# EAGLE design Stage_Driver_v7 (EAGLE 9.4.2)
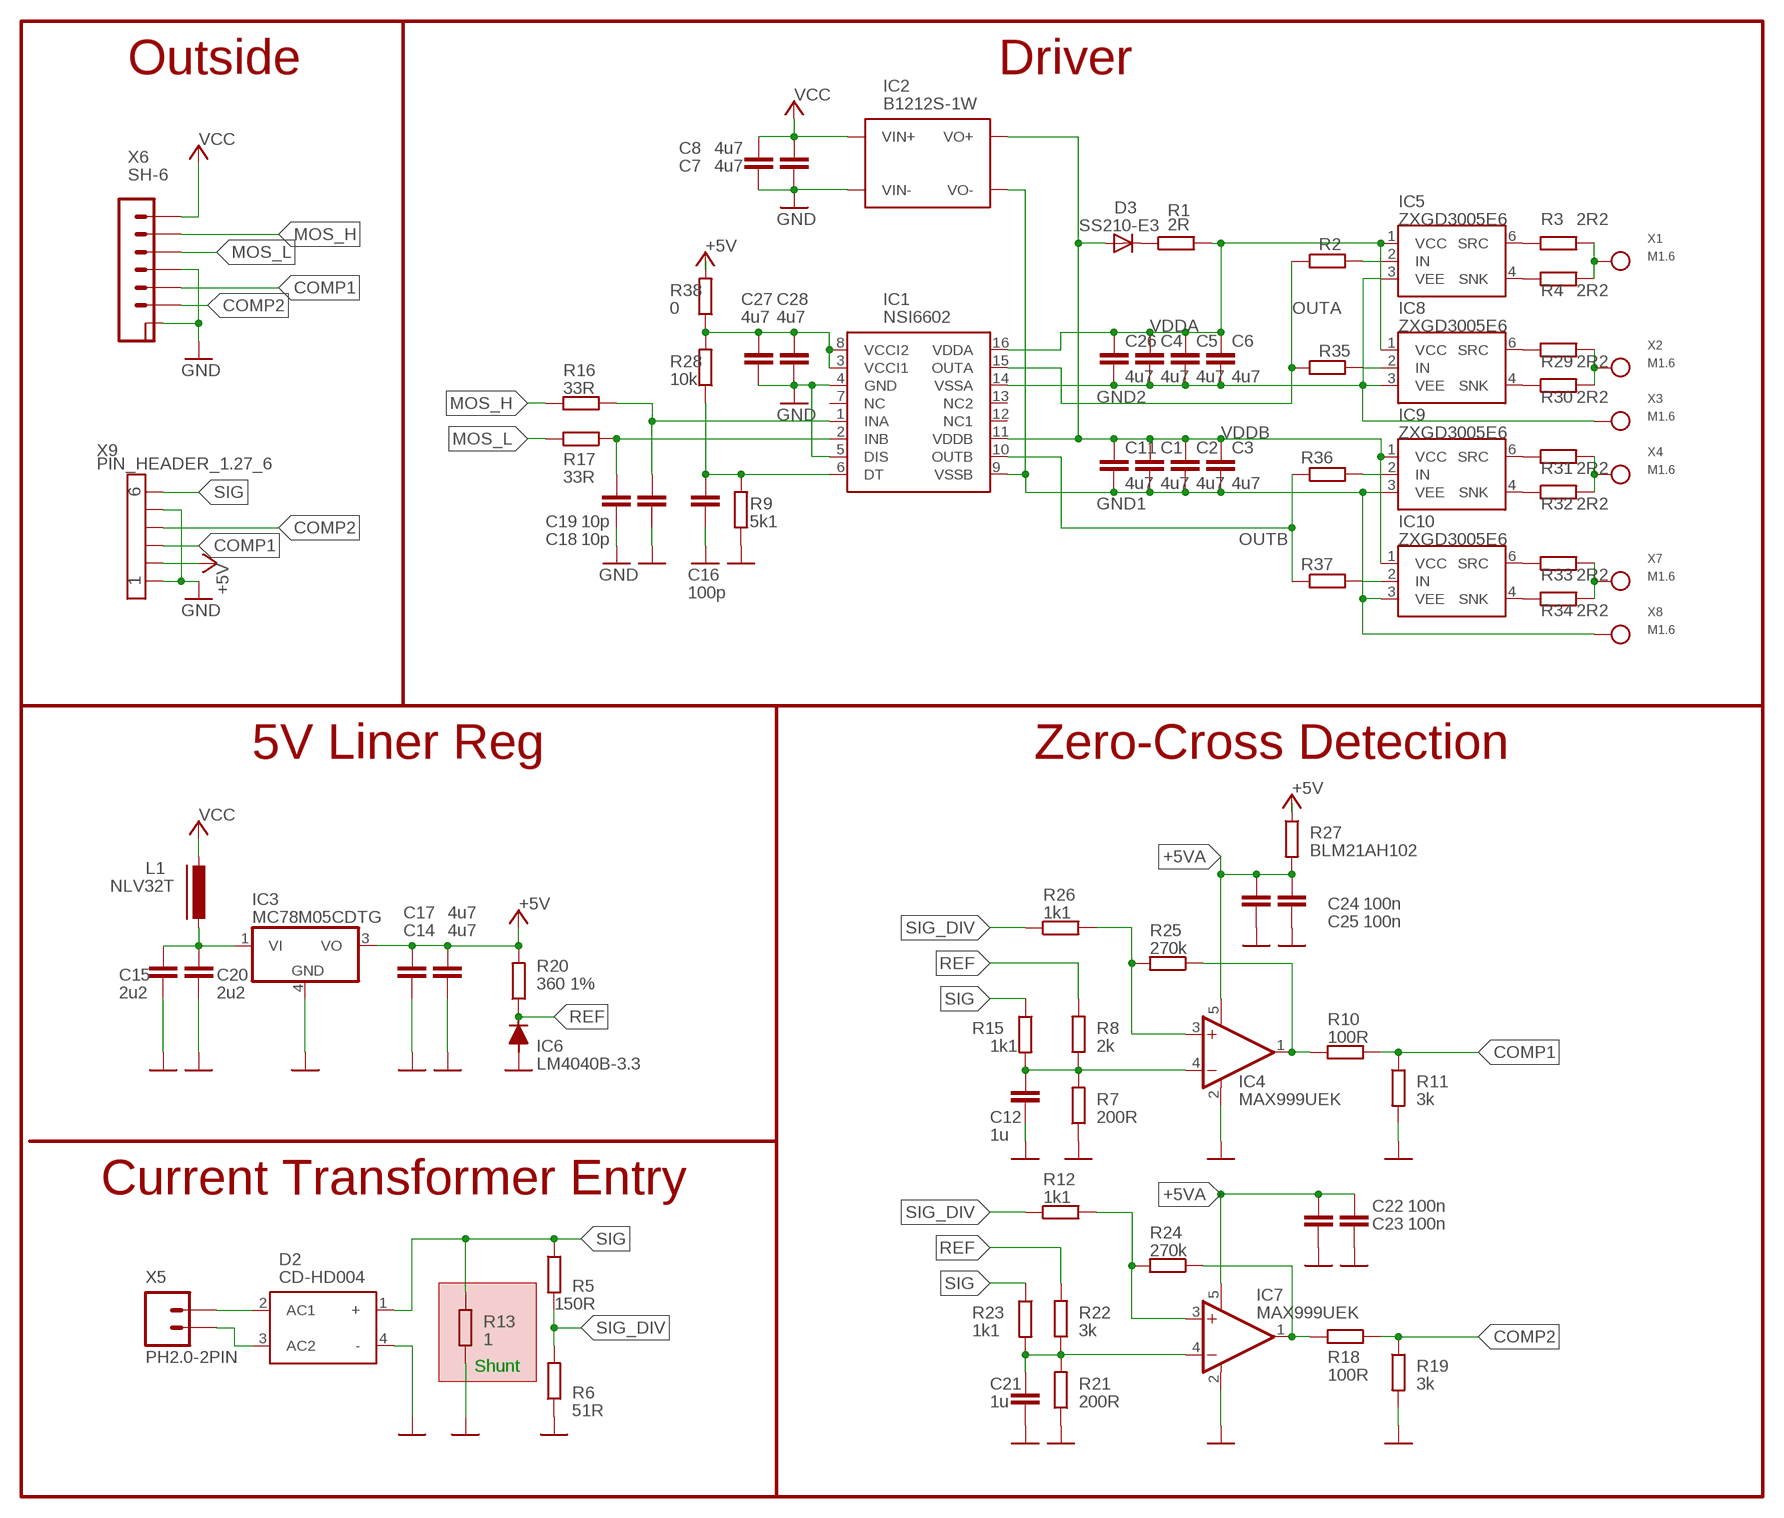
[diagram p0: schematic, sheet 1]

## Parts
C1  4u7  C-EUC0805  [C0805]
C2  4u7  C-EUC0805  [C0805]
C3  4u7  C-EUC0805  [C0805]
C4  4u7  C-EUC0805  [C0805]
C5  4u7  C-EUC0805  [C0805]
C6  4u7  C-EUC0805  [C0805]
C7  4u7  C-EUC0805  [C0805]
C8  4u7  C-EUC0805  [C0805]
C11  4u7  C-EUC0805  [C0805]
C12  1u  C-EUC0603  [C0603]
C14  4u7  C-EUC0805  [C0805]
C15  2u2  C-EUC0805  [C0805]
C16  100p  C-EUC0603  [C0603]
C17  4u7  C-EUC0805  [C0805]
C18  10p  C-EUC0603  [C0603]
C19  10p  C-EUC0603  [C0603]
C20  2u2  C-EUC0805  [C0805]
C21  1u  C-EUC0603  [C0603]
C22  100n  C-EUC0603  [C0603]
C23  100n  C-EUC0603  [C0603]
C24  100n  C-EUC0603  [C0603]
C25  100n  C-EUC0603  [C0603]
C26  4u7  C-EUC0805  [C0805]
C27  4u7  C-EUC0603  [C0603]
C28  4u7  C-EUC0603  [C0603]
D2  CD-HD004  [CD-HD0X]
D3  SS210-E3  [DO-214AA(SMB)]
IC1  NSI6602  [SOIC16]
IC2  B1212S-1W  SIM1-XXXX-2  [BS-1WR3]
IC3  MC78M05CDTG  [DPACK_3]
IC4  MAX999UEK  [SOT-23-5]
IC5  ZXGD3005E6  [SOT-23-6]
IC6  LM4040B-3.3  LM4040  [SOT-23]
IC7  MAX999UEK  [SOT-23-5]
IC8  ZXGD3005E6  [SOT-23-6]
IC9  ZXGD3005E6  [SOT-23-6]
IC10  ZXGD3005E6  [SOT-23-6]
L1  NLV32T  [NLV32T]
R1  2R  R-EU_R1210  [R1210]
R2  R-EU_R0603  [R0603]
R3  2R2  R-EU_R0603  [R0603]
R4  2R2  R-EU_R0603  [R0603]
R5  150R  R-EU_R0805  [R0805]
R6  51R  R-EU_R0805  [R0805]
R7  200R  R-EU_R0603  [R0603]
R8  2k  R-EU_R0603  [R0603]
R9  5k1  R-EU_R0603  [R0603]
R10  100R  R-EU_R0603  [R0603]
R11  3k  R-EU_R0603  [R0603]
R12  1k1  R-EU_R0603  [R0603]
R13  1  R-EU_R1210  [R1210]
R15  1k1  R-EU_R0603  [R0603]
R16  33R  R-EU_R0603  [R0603]
R17  33R  R-EU_R0603  [R0603]
R18  100R  R-EU_R0603  [R0603]
R19  3k  R-EU_R0603  [R0603]
R20  360 1%  R-EU_R0805  [R0805]
R21  200R  R-EU_R0603  [R0603]
R22  3k  R-EU_R0603  [R0603]
R23  1k1  R-EU_R0603  [R0603]
R24  270k  R-EU_R0603  [R0603]
R25  270k  R-EU_R0603  [R0603]
R26  1k1  R-EU_R0603  [R0603]
R27  BLM21AH102  R-EU_R0805  [R0805]
R28  10k  R-EU_R0603  [R0603]
R29  2R2  R-EU_R0603  [R0603]
R30  2R2  R-EU_R0603  [R0603]
R31  2R2  R-EU_R0603  [R0603]
R32  2R2  R-EU_R0603  [R0603]
R33  2R2  R-EU_R0603  [R0603]
R34  2R2  R-EU_R0603  [R0603]
R35  R-EU_R0603  [R0603]
R36  R-EU_R0603  [R0603]
R37  R-EU_R0603  [R0603]
R38  0  R-EU_R0805  [R0805]
X1  M1.6  [M1.6]
X2  M1.6  [M1.6]
X3  M1.6  [M1.6]
X4  M1.6  [M1.6]
X5  PH2.0-2PIN  [PH2.0-2PIN]
X6  SH-6  [SH-6]
X7  M1.6  [M1.6]
X8  M1.6  [M1.6]
X9  PIN_HEADER_1.27_6  [PIN_HEADER_1.27_6]

## Nets
+5V: C14.1 C17.1 IC3.3(VO) R20.2 R27.1 R38.2 X9.P$2
+5VA: C22.1 C23.1 C24.1 C25.1 IC4.5(V+) IC7.5(V+) R27.2
COMP1: R10.1 R11.1 X6.P$5 X9.P$3
COMP2: R18.1 R19.1 X6.P$6 X9.P$4
GND: C7.2 C8.2 C12.2 C14.2 C15.2 C16.2 C17.2 C18.2 C19.2 C20.2 C21.2 C22.2 C23.2 C24.2 C25.2 C27.2 C28.2 D2.4(-) IC1.4(GND) IC1.5(DIS) IC2.P$1(VIN-) IC3.4(GND) IC4.2(V-) IC6.2(A) IC7.2(V-) R6.1 R7.1 R9.1 R11.2 R13.1 R19.2 R21.1 X6.G1(G) X6.G2(G) X6.P$4 X9.P$1 X9.P$5
GND1: C1.2 C2.2 C3.2 C11.2 IC1.9(VSSB) IC2.P$3(VO-) IC9.3(VEE) IC10.3(VEE) X8.P$1
GND2: C4.2 C5.2 C6.2 C26.2 IC1.14(VSSA) IC5.3(VEE) IC8.3(VEE) X3.P$1
MOS_H: R16.2 X6.P$2
MOS_L: R17.2 X6.P$3
N$1: IC7.3(+IN) R12.2 R24.2
N$2: D3.1(C) R1.1
N$3: C21.1 IC7.4(-IN) R21.2 R22.1 R23.2
N$5: D2.2(AC1) X5.P$2
N$7: IC5.6(SRC) R3.1
N$8: IC5.2(IN) R2.2
N$9: C27.1 C28.1 IC1.3(VCCI1) IC1.8(VCCI2) R28.2 R38.1
N$10: IC7.1(OUT) R18.2 R24.1
N$11: C12.1 IC4.4(-IN) R7.2 R8.1 R15.2
N$12: C18.1 IC1.1(INA) R16.1
N$13: C19.1 IC1.2(INB) R17.1
N$15: C16.1 IC1.6(DT) R9.2 R28.1
N$16: IC4.1(OUT) R10.2 R25.1
N$17: D2.3(AC2) X5.P$1
N$18: C15.1 C20.1 IC3.1(VI) L1.P$1
N$19: IC4.3(+IN) R25.2 R26.2
N$21: IC5.4(SNK) R4.1
N$22: IC8.6(SRC) R29.1
N$23: IC8.4(SNK) R30.1
N$24: IC9.6(SRC) R31.1
N$25: IC9.4(SNK) R32.1
N$26: IC10.6(SRC) R33.1
N$27: IC10.4(SNK) R34.1
N$28: R29.2 R30.2 X2.P$1
N$29: R31.2 R32.2 X4.P$1
N$30: R33.2 R34.2 X7.P$1
N$31: IC8.2(IN) R35.2
N$32: IC9.2(IN) R36.2
N$33: IC10.2(IN) R37.2
OUTA: IC1.15(OUTA) R2.1 R35.1
OUTB: IC1.10(OUTB) R36.1 R37.1
REF: IC6.1(K) R8.2 R20.1 R22.2
SIG: D2.1(+) R5.1 R13.2 R15.1 R23.1 X9.P$6
SIG_DIV: R5.2 R6.2 R12.1 R26.1
VCC: C7.1 C8.1 IC2.P$2(VIN+) L1.P$2 X6.P$1
VDDA: C4.1 C5.1 C6.1 C26.1 IC1.16(VDDA) IC5.1(VCC) IC8.1(VCC) R1.2
VDDB: C1.1 C2.1 C3.1 C11.1 D3.2(A) IC1.11(VDDB) IC2.P$4(VO+) IC9.1(VCC) IC10.1(VCC)
X1-G: R3.2 R4.2 X1.P$1
Unconnected: IC1.7(NC) IC1.12(NC1) IC1.13(NC2)

## Notes on the sheet
- Outside | Driver
- 5V Liner Reg | Zero-Cross Detection
- Current Transformer Entry
- Shunt

## Library data of the parts
C1-C8 C11 C12 C14-C28 = with-caps:C-EU: CAPACITOR, European symbol
D2 = with-diodes:CD-HD004: Shottky Bridge Rectifier 40V 1A https://ru.mouser.com/datasheet/2/54/cd_hd2xl-1067099.pdf
D3 = with-diodes:SS210-E3: Schottky Diodes & Rectifiers 100 Volt 1.5 Amp 75 Amp IFSM Source: Datasheet <https://www.vishay.com/docs/88749/ss29.pdf>; DESCRIPTION: Schottky Diodes & Rectifiers 100 Volt 1.5 Amp 75 Amp IFSM; HEIGHT: 2.44mm; MANUFACTURER_NAME: Vishay; MANUFACTURER_PART_NUMBER: SS210-E3/5BT; MOUSER_PART_NUMBER: 625-SS210-E3/5BT; MOUSER_PRICE-STOCK: https://www.mouser.co.uk/ProductDetail/Vishay-Semiconductors/SS210-E3-5BT?qs=x2jpVgRnAtPMBJOnwod61w%3D%3D
IC1 = with-ICs:NSI6602: NOSOSENSE Dual Side Gate Driver 4A / 6A 2500Vrms * 20ns min ppulse * Inputside supply voltage: 2.7V to 5.5V * Driverside supply voltage: up to 25V with UVLO
IC2 = with-dc_dc:SIM1-XXXX-2
IC3 = with-ICs:MC78M: 500 mA Positive Voltage Regulators Source: Data sheet <http://www.onsemi.com/pub_link/Collateral/MC78M00-D.PDF>
IC4 IC7 = with-ICs:MAX999UEK: Single Supply 4,5ns comparator
IC5 IC8-IC10 = with-ICs:ZXGD3005E6: DIODES 25V 10A Gate Driver in STO26 * lower10ns delay * lower 20ns Rise/Fall * Low Input Current of 1mA to Deliver 4A Output Current
IC6 = with-ICs:LM4040: LM4040 Precision Micropower Shunt Voltage Reference • Fixed Output Voltages of 2.048 V, 2.5 V, 3 V, 4.096 V, 5 V, 8.192 V, and 10 V • Tight Output Tolerances and Low Temperature Coefficient – Max 0.1%, 100 ppm/°C – A Grade – Max 0.2%, 100 ppm/°C – B Grade – Max 0.5%, 100 ppm/°C – C Grade – Max 1.0%, 150 ppm/°C – D Grade • Low Output Noise: 35 μVRMS Typ • Wide Operating Current Range: 45 μA Typ to 15 mA
L1 = with-inductors:NLV32T: TDK Inductors grid 3.2mm
R1-R13 R15-R38 = with-resistors:R-EU_: RESISTOR, European symbol; SPICEPREFIX: R
X1-X4 X7 X8 = with-con:M1.6: M1.6 Bolt to nut connection D=3mm d=1.7mm
X5 = with-con:PH2.0-2PIN: grid = 2mm http://www.dart.ru/cataloguenew/connectors/wire-to-board/jst/pdf/2-0-ph.pdf
X6 = with-con:SH-6: 1.0mm pitch connector
X9 = with-con:PIN_HEADER_1.27_6: grid 1.27

## Board
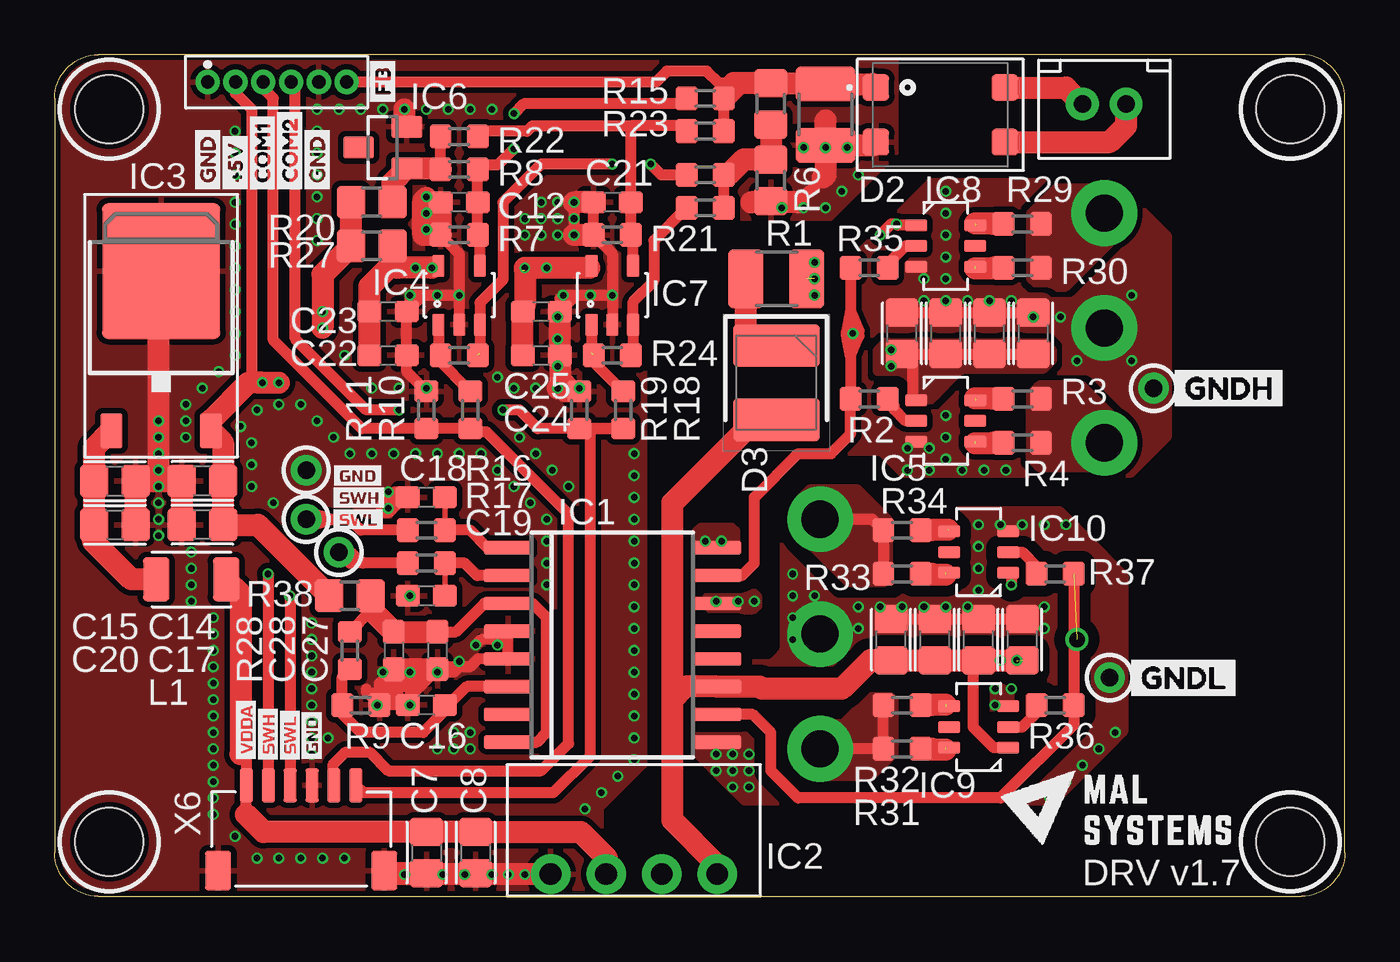
[diagram p1: board, top side]
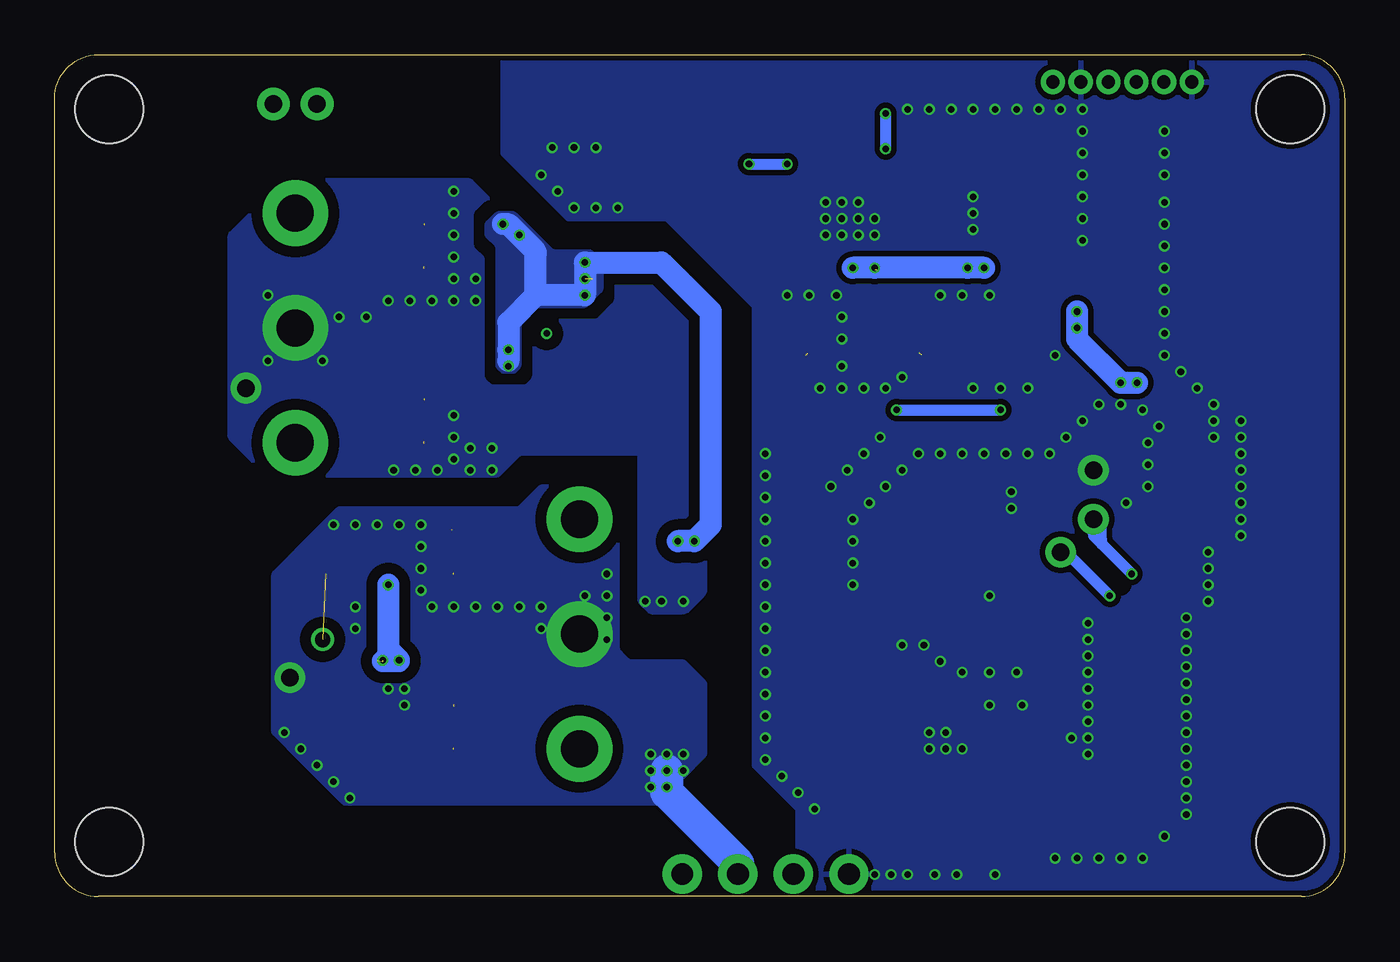
[diagram p2: board, bottom side, seen from below]

Size 59 x 38.5 mm. Coordinates in mm from the lower left corner, seen from the top.
Outline: 2,0 57,0 arc90 59,2 59,36.5 arc90 57,38.5 2,38.5 arc90 0,36.5 0,2 arc90 2,0
Copper layers (1*16): Top 0.035mm / dielectric 1.5mm / Bottom 0.035mm
Design rules "default *": minimum track width 0.2mm, minimum drill 0.2mm, track to track 0.25mm, track to pad 0.25mm, pad to pad 0.25mm, via to via 0.25mm, smd to smd 0.25mm, copper to edge 0.25mm, drill to drill 0.25mm, minimum pad ring 10mil, minimum via ring 0.05mm, stop-mask expansion 4mil, vias tented up to drill 0.35mm, thermal gap 10mil
Holes 3.1 mm at 2.5,2.5 2.5,36 56.5,36 56.5,2.5
bRestrict: 1 lines

### Footprints (pad centres in the part's own frame; a part is rotated, then mirrored left to right if it is on the bottom)
C0805 = smd 1.3 x 1.5: 1 -0.95,0; 2 0.95,0
C0603 = smd 1.1 x 1: 1 -0.85,0; 2 0.85,0
CD-HD0X = smd 1.2 x 1.2: 1 1.25,2.95; 2 1.25,-2.95; 3 -1.25,-2.95; 4 -1.25,2.95
DO-214AA(SMB) = smd 1.95 x 3.95: 1 -1.7,0; 2 1.7,0
SOIC16 = smd 0.6 x 2.2: 1 -4.445,-4.775; 2 -3.175,-4.775; 3 -1.905,-4.775; 4 -0.635,-4.775; 5 0.635,-4.775; 6 1.905,-4.775; 7 3.175,-4.775; 8 4.445,-4.775; 9 4.445,4.8; 10 3.175,4.8; 11 1.905,4.8; 12 0.635,4.8; 13 -0.635,4.8; 14 -1.905,4.8; 15 -3.175,4.8; 16 -4.445,4.8
BS-1WR3 = drill 1 pad 1.8: P$1 0,0; P$2 2.54,0; P$3 5.08,0; P$4 7.62,0
DPACK_3 = smd 1 x 1.6: 1 -2.28,-4.8; 3 2.28,-4.8 | smd 5.4 x 6.2: 4 0,2.5
SOT-23-5 = smd 0.55 x 1: 1 -0.95,-1.35; 2 0,-1.35; 3 0.95,-1.35; 4 0.95,1.35; 5 -0.95,1.35
SOT-23-6 = smd 0.55 x 1: 1 -0.95,-1.35; 2 0,-1.35; 3 0.95,-1.35; 4 0.95,1.35; 5 0,1.35; 6 -0.95,1.35
SOT-23 = smd 1 x 1.4: 1 -0.95,-1.1; 2 0.95,-1.1; 3 0,1.1
NLV32T = smd 1.2 x 2: P$1 -1.6,0; P$2 1.6,0
R1210 = smd 1.6 x 2.7: 1 -1.4,0; 2 1.4,0
R0603 = smd 1 x 1.1: 1 -0.85,0; 2 0.85,0
R0805 = smd 1.3 x 1.5: 1 -0.95,0; 2 0.95,0
M1.6 = drill 1.7 pad 3: P$1 0,0
PH2.0-2PIN = drill 0.8 pad 1.5: P$1 0,0; P$2 2,0
SH-6 = smd 1.2 x 1.8: G1 -1.3,-3.9; G2 6.3,-3.9 | smd 0.6 x 1.55: P$1 0,0; P$2 1,0; P$3 2,0; P$4 3,0; P$5 4,0; P$6 5,0
PIN_HEADER_1.27_6 = drill 0.6 pad 0.94: P$1 0,0; P$2 1.27,0; P$3 2.54,0; P$4 3.81,0; P$5 5.08,0; P$6 6.35,0

### Placement (x,y rotation side)
C1  38.25,11.75 90 top
C2  44.25,11.75 90 top
C3  42.25,11.75 90 top
C4  38.75,25.75 90 top
C5  40.75,25.75 90 top
C6  42.75,25.75 90 top
C7  17,2 270 top
C8  19.25,2 270 top
C11  40.25,11.75 90 top
C12  18.5,31.75 180 top
C14  6.75,17 180 top
C15  2.75,19 0 top
C16  17,8.75 180 top
C17  6.75,19 180 top
C18  17,18.25 180 top
C19  17,13.75 180 top
C20  2.75,17 0 top
C21  25.5,31.75 180 top
C22  15.25,24.75 0 top
C23  15.25,26.75 0 top
C24  22.25,24.75 0 top
C25  22.25,26.75 0 top
C26  44.75,25.75 90 top
C27  17.5,11.25 270 top
C28  15.5,11.25 270 top
D2  40.5,35.75 90 top
D3  33,23.5 270 top
IC1  25.5,11.5 270 top
IC2  22.68,1.02 0 top
IC3  4.87,26.1 0 top
IC4  18.5,27.5 0 top
IC5  40.75,21.75 270 top
IC6  15,34.25 90 top
IC7  25.5,27.5 0 top
IC8  40.75,29.75 270 top
IC9  42.25,7.75 90 top
IC10  42.25,15.75 90 top
L1  6.25,14.5 0 top
R1  33,28.25 0 top
R2  37.25,22.75 0 top
R3  44.25,22.75 0 top
R4  44.25,20.75 0 top
R5  32.75,36.25 270 top
R6  32.75,32.75 90 top
R7  18.5,30.25 0 top
R8  18.5,33.25 180 top
R9  14,8.75 180 top
R10  19,22.25 90 top
R11  17,22.25 90 top
R12  29.75,31.5 180 top
R13  35.25,35.75 90 top
R15  29.75,36.5 180 top
R16  17,16.75 180 top
R17  17,15.25 180 top
R18  26,22.25 90 top
R19  24,22.25 90 top
R20  14.5,31.75 180 top
R21  25.5,30.25 0 top
R22  18.5,34.75 180 top
R23  29.75,35 180 top
R24  25.5,24.75 0 top
R25  18.5,24.75 0 top
R26  29.75,33 180 top
R27  14.5,29.75 0 top
R28  13.5,11.25 90 top
R29  44.25,30.75 0 top
R30  44.25,28.75 0 top
R31  38.75,6.75 180 top
R32  38.75,8.75 180 top
R33  38.75,14.75 180 top
R34  38.75,16.75 180 top
R35  37.25,28.75 0 top
R36  45.75,8.75 180 top
R37  45.75,14.75 180 top
R38  13.5,13.75 180 top
U$1  [#5V1]  8.25,32 90 top
U$2  [COM12]  9.5,32 90 top
U$3  [GND0]  7,32 90 top
U$4  [COM23]  10.75,32 90 top
U$5  [GND0]  12,32 90 top
U$6  [FB4]  15,36 90 top
U$7  [SWL7]  12.5,17.25 0 top
U$8  [SWH6]  12.5,18.25 0 top
U$9  [GND0]  12.5,19.25 0 top
U$10  [GND0]  11.75,6 90 top
U$11  [SWL7]  10.75,6 90 top
U$12  [SWH6]  9.75,6 90 top
U$13  [VDDA12]  8.75,6 90 top
U$14  [GNDL0]  48.75,10 0 top
U$15  [GNDH1]  50.75,23.25 0 top
U$16  [14_#_#####_#_COPY#PNG]  48.5,4 0 top
X1  48,20.75 180 top
X2  48,31.25 180 top
X3  48,26 180 top
X4  35,6.75 180 top
X5  49,36.25 180 top
X6  8.77,5.08 0 top
X7  35,17.25 180 top
X8  35,12 180 top
X9  7,37.25 0 top

### Tracks (layer width: path | path; a pad name or v marks a point on that pad's centre or on a via)
+5V  (via drill 0.3 pad 0.5)
  Top 0.5: X9.P$2 8.27,36.73 9,36 9,23.35 8.85,23.5
  Top 1: R38.2 9.3,17 C14.1 C17.1 7.7,20.75 IC3.3 | 7.45,21 IC3.3 | R20.2 R27.1 12.25,28.45 v12.25,26.75 v12.25,26 | IC3.3 7.15,21.8 8.85,23.5 v9.5,23.5 | 9.35,23.5 v9.5,23.5 | v9.5,23.5 v10.25,23.5
  Bottom 1: v12.25,26.75 v12.25,26 12.25,25.5 v10.25,23.5 v9.5,23.5
+5VA  (via drill 0.3 pad 0.5)  (1 unrouted)
  Top 0.5: IC4.5 17.45,28.75 v17.25,28.75 | 21.4,28.65 v21.5,28.75 | 24.45,28.75 IC7.5
  Top 1: 15.45,29 15.45,28.95 14.4,27.9 C23.1 C22.1 | 15.45,29 R27.2 | v17.25,28.75 15.7,28.75 15.45,29 | C24.1 C25.1 21.4,26.94 21.5,27.04 21.5,28.65 | v21.5,28.75 v22.5,28.75 24.45,28.75
  Bottom 1: v16.5,28.75 v17.25,28.75 v21.5,28.75 v22.5,28.75
COMP1
  Top 0.5: X6.P$5 12.72,5.13 12.72,6.01 13.32,6.61 14.39,6.61 15.25,5.75 22.25,5.75 23.5,7 23.5,17.5 19.75,21.25 19,21.25 R10.1 R11.1 14.04,21.4 10,25.44 10,36.5 9.54,36.96 X9.P$3
COMP2  (via drill 0.3 pad 0.5)
  Top 0.5: X6.P$6 14.1,4.75 22.81,4.75 24.5,6.44 24.5,21.4 R18.1 R19.1 22.1,21.4 21.25,22.25 v20.5,22.25 | v15.75,22.25 14.25,22.25 11,25.5 11,37.06 X9.P$4
  Bottom 0.5: v20.5,22.25 v15.75,22.25
GND  (via drill 0.3 pad 0.5, 0.8 pad 1.4)
  Top 0.5: 35.12,32.88 34,31.75 | 17.65,30.75 R7.1 18.5,29.4 v18.5,27.5 | C21.2 R21.1 25.5,29.4 v25.5,27.5 | v25.5,27.5 IC7.2 | 23.85,27.5 C25.2 23.1,27.35 v23.25,27.5 23.85,27.5 | 23.85,27.5 v24.5,27.5 v25.5,27.5 | C23.2 C22.2 16.1,24 R11.2 | C23.2 16.85,27.5 | 16.85,27.5 v18.5,27.5 | v18.5,27.5 IC4.2 | 18.5,10.5 19,10.5 19.36,10.87 IC1.5 IC1.4 20.34,11.75 19.5,11.75 v19.25,11.5 | 18.5,10.5 17.6,10.5 C27.2 | 4.75,19 C17.2 5.8,18.75 5.8,17.25 C14.2 | 17.25,1.05 C7.2 | 15.5,1.05 15.2,1.05 X6.G2 | R9.1 14.85,9.75 15.05,9.95 | 15.05,9.95 C28.2 | C16.2 R9.1 | R19.2 23.1,24 C24.2 | C23.2 16.25,26.9 v16.25,27.5 16.85,27.5 | v23.75,31.75 v23.75,31 v23.75,30.25 | 18.5,10.5 18.25,10.25 v15,10.25 | C28.2 15.35,10.25 v15,10.25 | R9.1 14.3,9.3 | 14.3,9.3 14.26,9.34 14.26,9.49 | 15.6,9.3 15.32,9.57 | 15.32,9.57 15.05,9.85 | 15.05,9.85 15.05,9.95 | 14.3,9.3 15.25,9.3 | 15.25,9.3 15.6,9.3 | C16.2 15.8,8.75 15.25,9.3 | 15.57,9.57 v16.25,10.25 v15,10.25 | 15.57,9.57 15.32,9.57 | C16.2 15.6,9.3 | C28.2 16.25,9.65 16.25,9.15 | 16.25,9.15 v16.25,8.75 | C27.2 16.25,9.15 | C27.2 16.68,9.57 15.57,9.57 | C27.2 16.95,9.85 15.05,9.85 | C27.2 16.93,9.82
  Top 1: 19.28,1.02 C8.2 | C7.2 15.5,1.05 | C20.2 C15.2 4.75,19 | 4.75,19 5.55,19 5.8,18.75 | C17.2 5.8,17.25 | 4.75,19 4.75,28.48 IC3.4 | C28.2 C27.2 | R13.1 37.4,34.35 D2.4 | IC2.P$1 15.23,1.02 X6.G2 | 23.1,23.35 C24.2 C25.2 | 23.1,23.35 v23,23.25 | R19.2 23.35,23.1 23.1,23.35 | R21.1 v23.75,30.25 | C21.2 v23.75,31.75 | R7.1 16.85,30.25 16.85,31.8 17,31.95 | C12.2 17.65,30.75 | IC6.2 16,35.3 v16,36 | 34,31.75 32.8,31.75 R6.1 32.7,31.75 31.85,31.75 | R13.1 35.25,33 35.12,32.88 | R13.1 35.25,35.5 | C18.2 15.63,18.25 15.19,17.81
  other vias: 17.5,27.5 15.25,17.75 15.25,18.5 35.25,34.25 33.25,31.5 34.25,31.5 35.25,31.5 36,32.25 36.75,33 36.25,34.25 34.25,34.25 17.5,10.25 14.75,8.75 20.25,11.5 18.5,10.75 11.5,19.5 17,32 17,31.25 17,30.5 11.75,12.5 11.75,11.75 11.75,11 11.75,10.25 11.75,9.5 11.75,8.75 11.75,8 11.75,7.25 11.75,6.5 12.5,7.25 17.5,6.75 18.25,6.75 18.25,7.5 19,7.5 19,6.75 20,36 19,36 18,36 17,36 15,36 14,36 13,36 12,36 12,35 12,34 12,33 12,32 12,31 12,30 7.25,12.75 7.25,12 7.25,11.25 7.25,10.5 7.25,9.75 7.25,9 7.25,8.25 7.25,7.5 7.25,6.75 7.25,6 7.25,5.25 7.25,4.5 21.5,1 20.75,1 20,1 18.75,1 17.75,1 16,1 6.25,13.5 6.25,14.25 6.25,15 6.25,15.75 4.75,16.5 4.75,17.25 4.75,18 4.75,18.75 4.75,19.5 4.75,20.25 4.75,21 4.75,21.75 6,21 6,21.75 6,22.5 6.75,23.25 7.5,24 8.25,24.75 8.25,25.75 8.25,26.75 8.25,27.75 8.25,28.75 8.25,29.75 8.25,30.75 8.25,31.75 8.25,33 8.25,34 8.25,35 7.25,3.75 8.25,2.75 9.25,1.75 10.25,1.75 11.25,1.75 12.25,1.75 13.25,1.75 24.25,4 25,4.75 25.75,5.5 26.5,6.25 26.5,7.25 26.5,8.25 26.5,9.25 26.5,10.25 26.5,11.25 26.5,12.25 26.5,13.25 26.5,14.25 26.5,15.25 26.5,16.25 26.5,17.25 26.5,18.25 26.5,19.25 26.5,20.25 23,26.5 23,25.5 23,24.25 24,23.25 22,23.25 21,23.25 20.25,23.75 17,23.25 13.25,24.75 14.5,23.25 15.75,23.25 23,31.75 23,31 23,30.25 22.25,30.25 22.25,31 22.25,31.75 21.5,31 21.5,30.25 23.5,18.75 22.75,19.5 22,20.25 21.25,21 19.5,20.25 20.25,19.5 21,18.75 21.75,18 22.5,17.25 22.5,16.25 22.5,15.25 22.5,14.25 18.5,20.25 17.5,20.25 16.5,20.25 15.5,20.25 14.5,20.25 13.5,20.25 12.75,21 12,21.75 11.25,22.5 10.25,22.5 9.25,22.25 8.5,21.5 9,20.75 9,19.75 9,18.75 10,18 16.25,13.75
  pour Bottom (isolate 0.25, rank 3): -2.75,42 -2.75,-1.25 25,-1.25 25,4 27,6 27,27 31,31 35.5,31 38.5,34 38.5,42
  pour Top (isolate 0.25, rank 3): 36,40.75 -0.5,40.75 -0.5,-2.5 25,-2.5 25,4 27,6 27,27 31,31 35.5,31 38.5,34 38.5,39.75 37.5,40.75
GND1  (via drill 0.3 pad 0.5, 0.8 pad 1.4)
  Top 0.5: C1.2 C11.2 C3.2 C2.2
  Bottom 1.5: IC2.P$3 27.76,1.51 31,4.75 v31,5.75
  other vias: 43,8.75 43,9.5 43.75,9.5 30.25,6.5 31,6.5 30.25,5.75 31.75,5.75 31.75,6.5 31.75,5 31,5 45.5,4.5 46.25,5.25 47,6 47.75,6.75 48.5,7.5 33.75,14.75 33.75,13.75 33.75,12.75 33.75,11.75 34.75,13.75 36.75,13.25 37.75,13.25 38.75,13.25 39.75,13.25 40.75,13.25 41.75,13.25 42.25,14 42.25,15 42.25,16 42.25,17 43.25,17 44.25,17 45.25,17 46.25,17 45.25,13.25 45.25,12.25 36.75,12.25 48.25,10
  pour Bottom (isolate 0.5, rank 3, no thermals): 40.75,4.25 31.6,4.25 arc-45 31.43,4.32 30.25,5.5 29.32,6.43 arc-45 29.25,6.6 29.25,8 29.25,9.65 arc-45 29.32,9.82 29.5,10 30.18,10.68 arc-45 30.35,10.75 32.5,10.75 32.65,10.75 arc45 32.82,10.82 33,11 33.18,11.18 arc45 33.25,11.35 33.25,12.25 33.25,17.4 arc-45 33.32,17.57 33.75,18 34.43,18.68 arc-45 34.6,18.75 35.5,18.75 36.65,18.75 arc-45 36.82,18.68 37.25,18.25 37.68,17.82 arc45 37.85,17.75 41,17.75 45.9,17.75 arc-45 46.07,17.68 47,16.75 48.93,14.82 arc-45 49,14.65 49,12 49,7.6 arc-45 48.93,7.43 47.75,6.25 45.82,4.32 arc-45 45.65,4.25 41.25,4.25
  pour Top (isolate 0.5, rank 3, no thermals): 43.5,4.25 31.6,4.25 arc-45 31.43,4.32 30.5,5.25 29.32,6.43 arc-45 29.25,6.6 29.25,8.5 29.25,9.65 arc-45 29.32,9.82 29.5,10 30.18,10.68 arc-45 30.35,10.75 32,10.75 32.65,10.75 arc45 32.82,10.82 33,11 33.18,11.18 arc45 33.25,11.35 33.25,12.5 33.25,17.4 arc-45 33.32,17.57 34,18.25 34.43,18.68 arc-45 34.6,18.75 36,18.75 36.65,18.75 arc-45 36.82,18.68 37.25,18.25 37.68,17.82 arc45 37.85,17.75 39.25,17.75 45.9,17.75 arc-45 46.07,17.68 47.25,16.5 48.93,14.82 arc-45 49,14.65 49,11.5 49,7.6 arc-45 48.93,7.43 48.25,6.75 45.82,4.32 arc-45 45.65,4.25 44,4.25
GND2  (via drill 0.3 pad 0.5, 0.8 pad 1.4)
  Top 0.5: C4.2 C5.2 C6.2 C26.2
  other vias: 41.5,19.5 40.75,20 40.75,21 40.75,22 39.75,27.25 40.75,27.25 41.75,27.25 42.75,27.25 43.75,27.25 40.75,28.25 40.75,29.25 40.75,30.25 40.75,31.25 40.75,32.25 40,19.5 39,19.5 42.5,19.5 43.5,19.5 44.75,26.5 46,26.5 46.75,24.5 49.25,24.5 49.25,27.5 39,20.5 40,20.5 39.75,28.25 32,13.5 31.25,13.5 30.25,13.5 50.25,23.25
  pour Top (isolate 0.25, rank 2, no thermals): 48.4,32.75 40.1,32.75 arc45 39.93,32.68 36.82,29.57 arc-45 36.65,29.5 31.1,29.5 arc45 30.93,29.43 30.75,29.25 30.5,29.25 29.32,28.07 arc45 29.25,27.9 29.25,21.85 arc45 29.75,21.25 30.5,21.25 31.43,20.32 arc45 31.6,20.25 37.65,20.25 arc-45 37.82,20.18 38.68,19.32 arc45 38.85,19.25 49.15,19.25 arc45 49.32,19.32 50.93,20.93 arc45 51,21.1 51,30.15 arc45 50.93,30.32 48.57,32.68 arc45
  pour Bottom (isolate 0.5, rank 3, no thermals): 48.4,32.75 40.1,32.75 arc45 39.93,32.68 37.07,29.82 arc-45 36.9,29.75 31.1,29.75 arc45 30.5,29.5 29.32,28.32 arc45 29.25,28.15 29.25,21.85 arc45 29.5,21.5 30.25,21.5 31.43,20.32 arc45 31.6,20.25 37.65,20.25 arc-45 37.82,20.18 38.68,19.32 arc45 38.85,19.25 49.15,19.25 arc45 49.32,19.32 50.93,20.93 arc45 51,21.1 51,30.15 arc45 50.93,30.32 48.57,32.68 arc45
  pour Bottom (isolate 0.5, rank 3, no thermals): 29.25,22.25 29.25,14.1 arc45 29.4,13.75 30,13.15 arc45 30.35,13 31.65,13 arc45 31.82,13.07 32.18,13.43 arc45 32.25,13.6 32.25,22.25
  pour Top (isolate 0.5, no thermals): 30.25,13 31.9,13 arc45 32.07,13.07 32.25,13.25 32.25,13.75 32.07,13.93 arc45 31.9,14 30.75,14 30.1,14 arc45 29.93,13.93 29.75,13.75 29.75,13.5 29.75,13.35 arc45 29.82,13.18 30,13
MOS_H  (via drill 0.3 pad 0.5, 0.8 pad 1.4)
  Top 0.5: v9.75,14.75 9.77,14.73 X6.P$2 | R16.2 14,16.75 13.5,17.25 12.7,17.25 | 12.7,17.25 v11.5,17.25 | 12.7,17.25 11.6,17.59 v11.5,17.25 | 12.7,17.25 11.6,16.91 v11.5,17.25
  Bottom 0.5: v11.5,17.25 11.5,16.5 11.11,16.11 | 11.11,16.11 v9.75,14.75 | 11.11,16.11 11.79,17.04 v11.5,17.25 | 11.11,16.11 11.15,17.26 v11.5,17.25
MOS_L  (via drill 0.3 pad 0.5, 0.8 pad 1.4)
  Top 0.5: R17.2 14.09,15.25 | 14.09,15.25 13.5,15.25 v13,15.75 | v10.75,13.75 10.77,13.73 X6.P$3 | 14.09,15.25 13.23,16.01 v13,15.75 | 14.09,15.25 12.95,15.4 v13,15.75
  Bottom 0.5: v13,15.75 12.75,15.75 v10.75,13.75
N$1
  Top 0.5: R24.2 26.45,24.85 IC7.3 26.45,27.2 27.4,28.15 27.4,30 R12.2
N$2
  Top 1: R1.1 31.6,25.85 32.25,25.2 D3.1
N$3
  Top 0.5: IC7.4 26.45,30.15 R21.2 C21.1 26.35,35.25 | R22.1 19.6,35 21.6,35 21.85,35.25 26.35,35.25 | R23.2 28.65,35.25 26.35,35.25
N$5
  Top 1: D2.2 46.25,37 X5.P$2
N$7  (1 unrouted)
  Top 1: R3.1 42.89,22.75 42.86,22.77 42.1,22.77
N$8
  Top 0.5: R2.2 38.4,22.45 38.4,22.27 38.92,21.75 IC5.2
N$9
  Top 0.5: C27.1 18.35,12.1 19.66,13.4 IC1.3 21.84,13.4 22.5,12.75 22.5,7.5 22.05,7.05 IC1.8 | R28.2 14.45,13.05 R38.1
  Top 1: R38.1 14.45,13.15 C28.1 C27.1
N$10  (1 unrouted)
  Top 0.5: IC7.1 24.55,24.85 | R18.2 24.65,24.45 R24.1
N$11  (via drill 0.3 pad 0.5)
  Top 0.5: IC4.4 19.45,30.15 R7.2 C12.1 R8.1 19.35,33.45 20.25,33.45 v21,34.2 | v21,35.8 21.45,36.25 28.5,36.25 28.75,36.5 R15.2
  Bottom 0.5: v21,35.8 v21,34.2
N$12
  Top 0.25: C18.1 R16.1
  Top 0.5: IC1.1 19.8,15.95 19,16.75 R16.1
N$13
  Top 0.25: R17.1 C19.1
  Top 0.5: IC1.2 19.32,14.68 18.75,15.25 R17.1
N$15
  Top 0.5: IC1.6 18.84,9.6 18,8.75 C16.1 17.85,8.5 16.85,7.5 14,7.5 13.15,8.35 R9.2 13.15,10.05 R28.1
N$16
  Top 0.5: IC4.1 17.55,24.85 | 17.55,24.85 R25.1 | R10.2 17.55,24.55 17.55,24.85
N$17
  Top 1: D2.3 48.25,34.5 49,35.25 X5.P$1
N$18
  Top 0.5: 1.75,16.95 C20.1
  Top 1: L1.P$1 3.5,14.5 1.75,16.25 1.75,16.95 | C20.1 C15.1 1.8,20.51 IC3.1
N$19  (via drill 0.3 pad 0.5)  (1 unrouted)
  Top 0.5: 19.45,24.85 IC4.3 19.45,27.15 20.5,28.2 20.5,31.75 22.25,33.5 v25.5,33.5 | R26.2 27.75,33 v27.25,33.5
  Bottom 0.5: v27.25,33.5 v25.5,33.5
N$21  (1 unrouted)
  Top 1: R4.1 42.89,20.75 42.86,20.73 42.1,20.73
N$22  (1 unrouted)
  Top 1: R29.1 42.89,30.75 42.86,30.77 42.75,30.77 42.1,30.77
N$23  (1 unrouted)
  Top 1: R30.1 42.89,28.75 42.86,28.73 42.75,28.73 42.1,28.73
N$24  (1 unrouted)
  Top 0.5: IC9.6 40.75,6.8
  Top 1: 40.75,6.72 40.14,6.72 40.11,6.75 R31.1
N$25  (1 unrouted)
  Top 0.5: IC9.4 40.75,8.7
  Top 1: R32.1 40.11,8.75 40.14,8.78 40.75,8.78
N$26  (1 unrouted)
  Top 0.5: IC10.6 40.75,14.8
  Top 1: 40.75,14.72 40.14,14.72 40.11,14.75 R33.1
N$27  (1 unrouted)
  Top 0.5: IC10.4 40.85,16.75
  Top 1: R34.1 40.11,16.75 40.14,16.77 40.85,16.77
N$28
  pour Top (isolate 0.5, no thermals): 48.25,32.5 45.85,32.5 arc45 45.68,32.43 45.25,32 44.57,31.32 arc45 44.5,31.15 44.5,31 44.5,28.5 44.5,28.35 arc45 44.57,28.18 44.75,28 44.93,27.82 arc45 45.1,27.75 45.25,27.75 46.15,27.75 arc45 46.32,27.82 48.75,30.25 48.75,31.9 arc45 48.68,32.07
N$29
  Top 0.5: 34.5,6.75 X4.P$1 R31.2 R32.2
  pour Top (isolate 0.5, no thermals): 34.75,8 35.9,8 arc45 36.07,8.07 36.5,8.5 37.18,9.18 arc-45 37.35,9.25 37.75,9.25 38.15,9.25 arc-45 38.32,9.18 38.5,9 38.5,6.5 38.25,6.25 37.32,5.32 arc-45 37.15,5.25 36.75,5.25 34.85,5.25 arc-45 34.68,5.32 34.25,5.75 34.25,7.4 arc-45 34.32,7.57
N$30
  Top 0.5: R33.2 R34.2 37.4,17.25 X7.P$1
  pour Top (isolate 0.5, no thermals): 34.5,16 36.18,14.32 arc45 36.35,14.25 37.5,14.25 37.9,14.25 arc45 38.07,14.32 38.25,14.5 38.25,17.15 arc45 38.18,17.32 37.25,18.25 36.82,18.68 arc45 36.65,18.75 36.5,18.75 34.6,18.75 arc45 34.43,18.68 34.25,18.5 34.07,18.32 arc45 34,18.15 34,17.25 34,16.6 arc45 34.07,16.43
N$31
  Top 0.5: IC8.2 38.92,29.75 38.1,28.93 R35.2
N$32
  Top 0.5: IC9.2 44.25,7.75 44.9,8.4 R36.2
N$33
  Top 0.5: IC10.2 44.25,15.75 44.9,15.1 R37.2
OUTA  (via drill 0.3 pad 0.5)
  Top 0.5: R35.1 36.4,26.8 | 36.4,26.8 36.4,25.75 | 36.4,25.75 36.4,24.7 | 36.4,24.7 R2.1 36.4,21.15 35.5,20.25 34,20.25 32,18.25 32,15.25 31.43,14.68 IC1.15 | v36.5,25.75 36.4,25.75 | 36.4,26.8 36.2,25.81 v36.5,25.75 | 36.4,26.8 36.78,25.86 v36.5,25.75 | 36.4,24.7 36.78,25.64 v36.5,25.75 | 36.4,24.7 36.2,25.69 v36.5,25.75
OUTB  (via drill 0.7)  (1 unrouted)
  Top 0.5: R37.1 R36.1 46.6,7.85 43.25,4.5 34,4.5 32.75,5.75 32.75,7.5 31.93,8.32 IC1.10
  other vias: 46.75,11.75
REF
  Top 0.5: R8.2 R22.2
  Top 1: R20.1 15.45,32.65 IC6.1 17.6,33.3 R8.2
SIG
  Top 0.5: R23.1 R15.1 | 34.5,37.2 35.2,37.2 R13.2 | 31.05,37.2 30.37,37.2 29.82,37.75 28,37.75 27.5,37.25 X9.P$6
  Top 1: R13.2 37.4,37.15 D2.1 | 34.5,37.2 R5.1 31.3,37.2 | 31.3,37.2 31.05,37.2 | 31.3,37.2 R15.1
SIG_DIV
  Top 0.5: R12.1 R26.1
  Top 1: R5.2 R6.2 31.5,33.7 30.8,33 R26.1
VCC
  Top 0.5: 8.75,3.75 8.75,5.06 | 8.75,5.06 X6.P$1 | 8.5,6.5 8.75,6.25 8.75,5.06
  Top 1: IC2.P$2 25.25,1.05 25.25,1.75 24.05,2.95 C8.1 C7.1 9.55,2.95 8.75,3.75 | L1.P$2 8.5,13.85 8.5,6.5
VDDA  (via drill 0.3 pad 0.5)  (1 unrouted)
  Top 0.5: C4.1 39.25,24.8 | 39.25,24.8 C5.1 | C5.1 41.2,24.8 41.25,24.75 40.8,24.75 C5.1 | C5.1 C6.1 C26.1 | IC5.1 39.25,22.85 39.25,24.8 | IC8.1 38.55,30.7 v38.5,30.75 38.25,30.75 v37.75,30.25 | IC1.16 31,15.95
  Bottom 1: 37,27.5 v34.75,27.5 v34.75,29 31.25,29 29,26.75 29,17 v29.75,16.25 v30.5,16.25 | 37,27.5 38.25,26.25 v38.25,25 38.25,24.5 | 37,27.5 37,29.4 arc-45 37.07,29.57 v37.75,30.25 38.18,30.68 arc-45 38.35,30.75 v38.5,30.75
  other vias: 38.25,24.25 34.75,28.25
  pour Top (isolate 0.5, no thermals): 39.5,22.5 39.9,22.5 arc45 40.07,22.57 40.25,22.75 41.43,23.93 arc-45 41.6,24 42,24 45,24 45.15,24 arc45 45.32,24.07 45.5,24.25 45.68,24.43 arc45 45.75,24.6 45.75,24.75 45.75,24.9 arc45 45.68,25.07 45.5,25.25 45.32,25.43 arc45 45.15,25.5 45,25.5 38.1,25.5 arc45 37.93,25.43 37.75,25.25 37.57,25.07 arc45 37.5,24.9 37.5,24.5 37.5,24.1 arc45 37.57,23.93 37.75,23.75 37.93,23.57 arc45 38.1,23.5 38.25,23.5 38.4,23.5 arc-45 38.57,23.43 38.75,23.25 39.25,22.75
  pour Bottom (isolate 0.5, no thermals): 38.1,31.25 arc45 37.93,31.18 36.32,29.57 arc-45 36.15,29.5 34.6,29.5 arc45 34.43,29.43 34.07,29.07 arc45 34,28.9 34,27.85 arc45 34.07,27.68 34.68,27.07 arc45 34.85,27 36.9,27 arc-45 37.07,26.93 37.68,26.32 arc-45 37.75,26.15 37.75,24.35 arc45 37.82,24.18 38,24 38.5,24 38.68,24.18 arc45 38.75,24.35 38.75,29.65 arc-45 38.82,29.82 39.18,30.18 arc45 39.25,30.35 39.25,30.65 arc45 39.18,30.82 38.82,31.18 arc45 38.65,31.25 38.5,31.25
  pour Top (isolate 0.25, no thermals): 31.25,16 31.25,16.75 31,17 29.75,17 29.5,17 29.25,16.75 29.25,16
VDDB  (via drill 0.3 pad 0.5)  (2 unrouted)
  Top 0.5: IC10.1 43.75,14.65 v43.75,14.25 | IC9.1 42.95,6.8 42,7.75 42,10.55 C3.1
  Top 1: C2.1 C3.1 C11.1 C1.1 37.3,10.8 36,9.5 32.34,9.5 32.25,9.6 IC1.11 28.84,9.6 28.25,9 | IC2.P$4 30.3,1.45 28.25,3.5 28.25,9 | 28.25,9 28.25,18 32.05,21.8 D3.2
  Bottom 0.5: v43.25,10.8 43.25,10.75
  Bottom 1: v43.75,14.25 43.75,11.3 v43.25,10.8 | 43.25,10.75 44,10.75
  other vias: 44,10.8
X1-G
  pour Top (isolate 0.5, no thermals): 48.25,19.5 45.1,19.5 arc-45 44.93,19.57 44.75,19.75 44.57,19.93 arc-45 44.5,20.1 44.5,20.25 44.5,22.9 arc-45 44.57,23.07 44.75,23.25 44.93,23.43 arc-45 45.1,23.5 45.25,23.5 46.9,23.5 arc-45 47.07,23.43 47.5,23 49.25,21.25 49.25,20.35 arc-45 49.18,20.18 48.75,19.75 48.57,19.57 arc-45 48.4,19.5

### Text on the board
tPlace: DRV v1.7